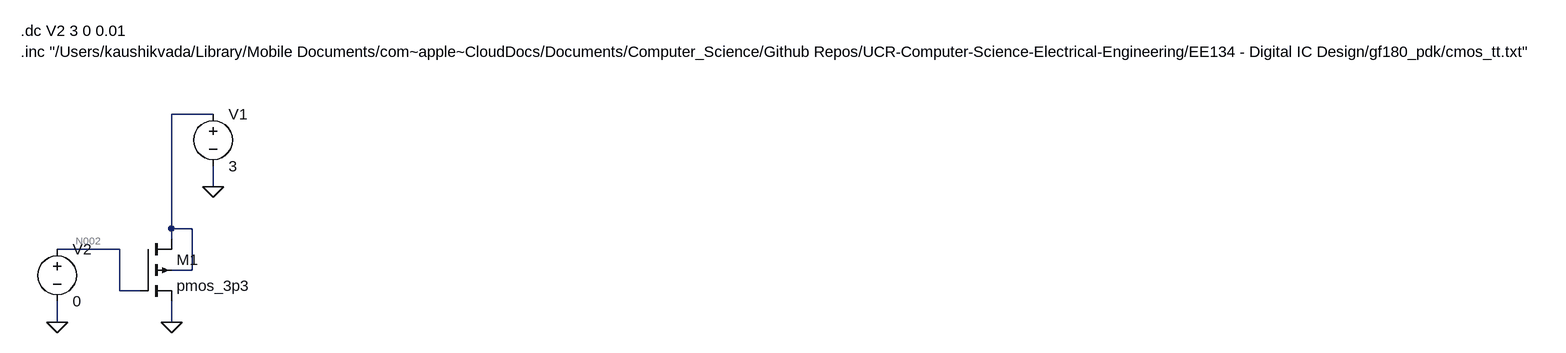
[diagram p0: schematic PMOS.asc]
PMOS.asc, the LTspice schematic file:
Version 4
SHEET 1 2396 680
WIRE 336 -64 272 -64
WIRE 336 48 336 16
WIRE 272 112 272 -64
WIRE 304 112 272 112
WIRE 272 128 272 112
WIRE 192 144 96 144
WIRE 304 176 304 112
WIRE 304 176 272 176
WIRE 192 208 192 144
WIRE 224 208 192 208
WIRE 96 256 96 224
WIRE 272 256 272 224
FLAG 336 48 0
FLAG 272 256 0
FLAG 96 256 0
SYMBOL pmos4 224 128 R0
SYMATTR InstName M1
SYMATTR Value pmos_3p3
SYMATTR Value2 l=1u w=4u
SYMBOL Voltage 336 -80 R0
SYMATTR InstName V1
SYMATTR Value 3
SYMBOL Voltage 96 128 R0
SYMATTR InstName V2
SYMATTR Value 0
TEXT 40 -160 Left 2 !.inc "/Users/kaushikvada/Library/Mobile Documents/com~apple~CloudDocs/Documents/Computer_Science/Github Repos/UCR-Computer-Science-Electrical-Engineering/EE134 - Digital IC Design/gf180_pdk/cmos_tt.txt"
TEXT 40 -192 Left 2 !.dc V2 3 0 0.01

The netlist it stands for:
* PMOS.asc
M1 N001 N002 0 N001 pmos_3p3 l=1u w=4u
V1 N001 0 3
V2 N002 0 0
.model NMOS NMOS
.model PMOS PMOS
.lib standard.mos
.inc "/Users/kaushikvada/Library/Mobile Documents/com~apple~CloudDocs/Documents/Computer_Science/Github Repos/UCR-Computer-Science-Electrical-Engineering/EE134 - Digital IC Design/gf180_pdk/cmos_tt.txt"
.dc V2 3 0 0.01
.backanno
.end

* Results of the author's LTspice run, read from the files saved beside the schematic
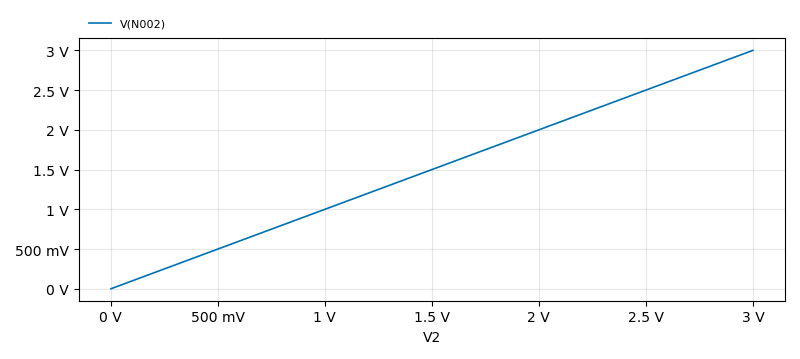
[diagram p1: DC transfer characteristic of PMOS.asc, plotted from the saved traces]
* DC transfer characteristic, 1 run:
*   V(N002): 3 V at V2=3 V, 0 V at V2=0 V, min 0 V, max 3 V